# EAGLE design Retrotink5x_backwards (EAGLE 9.1.3)
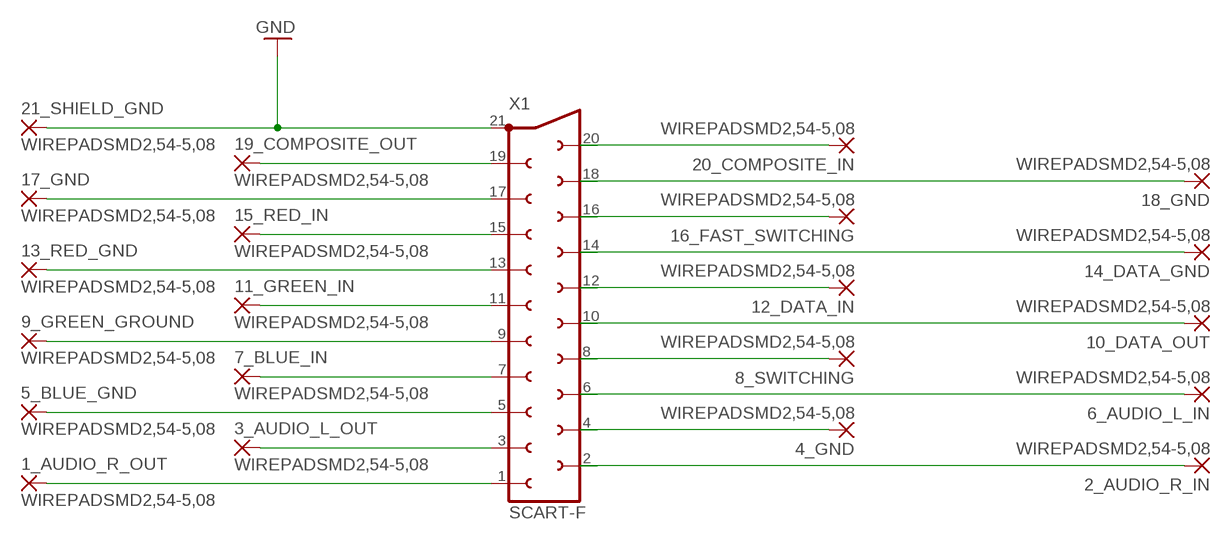
[diagram p0: schematic, sheet 1]

## Parts
1_AUDIO_R_OUT  WIREPADSMD2,54-5,08  [SMD2,54-5,08]
2_AUDIO_R_IN  WIREPADSMD2,54-5,08  [SMD2,54-5,08]
3_AUDIO_L_OUT  WIREPADSMD2,54-5,08  [SMD2,54-5,08]
4_GND  WIREPADSMD2,54-5,08  [SMD2,54-5,08]
5_BLUE_GND  WIREPADSMD2,54-5,08  [SMD2,54-5,08]
6_AUDIO_L_IN  WIREPADSMD2,54-5,08  [SMD2,54-5,08]
7_BLUE_IN  WIREPADSMD2,54-5,08  [SMD2,54-5,08]
8_SWITCHING  WIREPADSMD2,54-5,08  [SMD2,54-5,08]
9_GREEN_GROUND  WIREPADSMD2,54-5,08  [SMD2,54-5,08]
10_DATA_OUT  WIREPADSMD2,54-5,08  [SMD2,54-5,08]
11_GREEN_IN  WIREPADSMD2,54-5,08  [SMD2,54-5,08]
12_DATA_IN  WIREPADSMD2,54-5,08  [SMD2,54-5,08]
13_RED_GND  WIREPADSMD2,54-5,08  [SMD2,54-5,08]
14_DATA_GND  WIREPADSMD2,54-5,08  [SMD2,54-5,08]
15_RED_IN  WIREPADSMD2,54-5,08  [SMD2,54-5,08]
16_FAST_SWITCHING  WIREPADSMD2,54-5,08  [SMD2,54-5,08]
17_GND  WIREPADSMD2,54-5,08  [SMD2,54-5,08]
18_GND  WIREPADSMD2,54-5,08  [SMD2,54-5,08]
19_COMPOSITE_OUT  WIREPADSMD2,54-5,08  [SMD2,54-5,08]
20_COMPOSITE_IN  WIREPADSMD2,54-5,08  [SMD2,54-5,08]
21_SHIELD_GND  WIREPADSMD2,54-5,08  [SMD2,54-5,08]
X1  SCART-F  [SCART-F]

## Nets
GND: 21_SHIELD_GND.1(P) X1.21
N$1: 2_AUDIO_R_IN.1(P) X1.2
N$2: 1_AUDIO_R_OUT.1(P) X1.1
N$4: 20_COMPOSITE_IN.1(P) X1.20
N$5: 4_GND.1(P) X1.4
N$6: 6_AUDIO_L_IN.1(P) X1.6
N$7: 19_COMPOSITE_OUT.1(P) X1.19
N$8: 17_GND.1(P) X1.17
N$9: 18_GND.1(P) X1.18
N$10: 16_FAST_SWITCHING.1(P) X1.16
N$11: 15_RED_IN.1(P) X1.15
N$12: 3_AUDIO_L_OUT.1(P) X1.3
N$13: 5_BLUE_GND.1(P) X1.5
N$14: 7_BLUE_IN.1(P) X1.7
N$15: 8_SWITCHING.1(P) X1.8
N$16: 9_GREEN_GROUND.1(P) X1.9
N$17: 11_GREEN_IN.1(P) X1.11
N$18: 13_RED_GND.1(P) X1.13
N$19: 10_DATA_OUT.1(P) X1.10
N$20: 12_DATA_IN.1(P) X1.12
N$21: 14_DATA_GND.1(P) X1.14

## Library data of the parts
1_AUDIO_R_OUT 2_AUDIO_R_IN 3_AUDIO_L_OUT 4_GND 5_BLUE_GND 6_AUDIO_L_IN 7_BLUE_IN 8_SWITCHING 9_GREEN_GROUND 10_DATA_OUT 11_GREEN_IN 12_DATA_IN 13_RED_GND 14_DATA_GND 15_RED_IN 16_FAST_SWITCHING 17_GND 18_GND 19_COMPOSITE_OUT 20_COMPOSITE_IN 21_SHIELD_GND = wirepad:WIREPAD: Wire PAD connect wire on PCB
X1 = TRP_Custom:SCART-F: TV SCART CONNECTOR; OC_FARNELL: unknown; OC_NEWARK: unknown

## Board
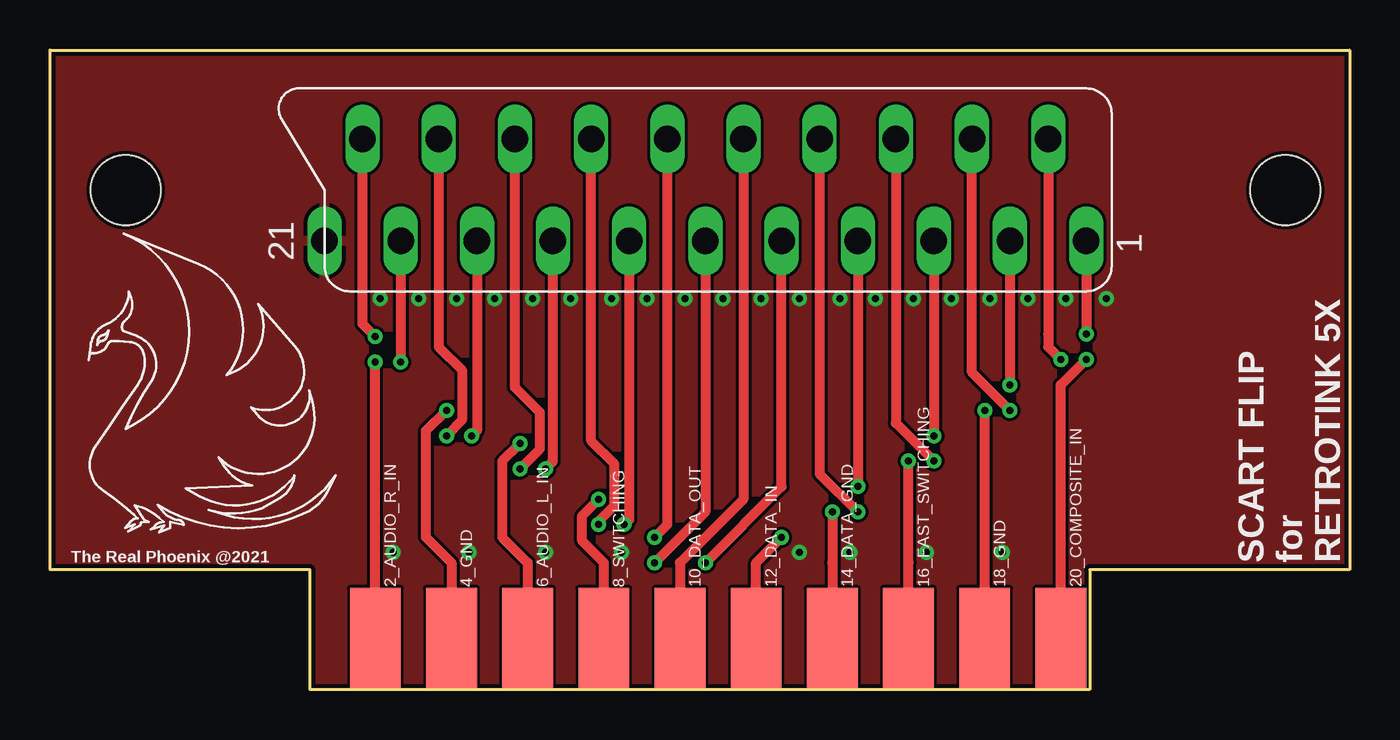
[diagram p1: board, top side]
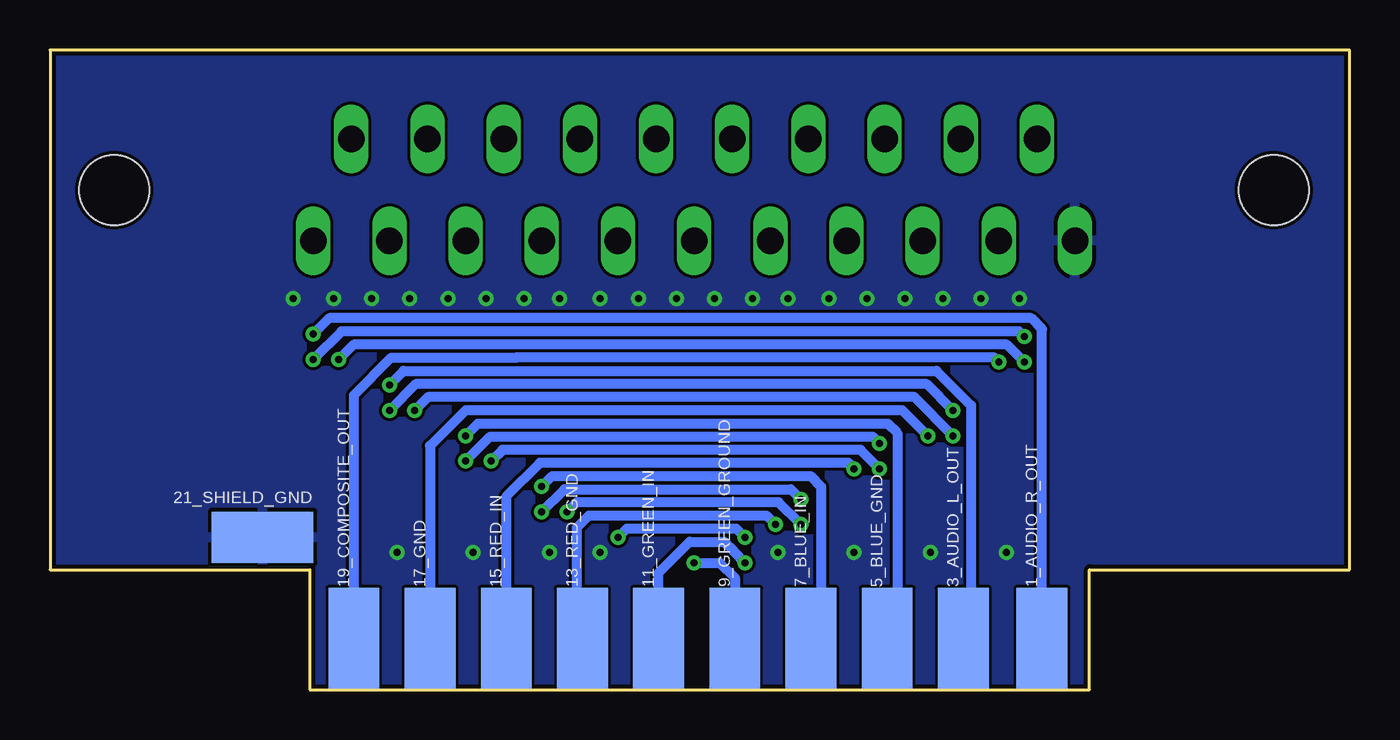
[diagram p2: board, bottom side, seen from below]

Size 65 x 32 mm. Coordinates in mm from the lower left corner, seen from the top.
Outline: 0,32 65,32 65,6 52,6 52,0 13,0 13,6 0,6 0,32
Copper layers (1*16): Top 0.035mm / dielectric 1.5mm / Bottom 0.035mm
Design rules "eC-PCB_proto-4-layer": minimum track width 0.15mm, minimum drill 0.25mm, track to track 0.15mm, track to pad 0.15mm, pad to pad 0.15mm, via to via 0.15mm, smd to smd 0.15mm, copper to edge 0.2mm, drill to drill 0.3mm, minimum pad ring 0.2mm, minimum via ring 0.2mm, stop-mask expansion 0.1mm, vias tented up to drill 0.6mm, thermal gap 0.2mm

### Footprints (pad centres in the part's own frame; a part is rotated, then mirrored left to right if it is on the bottom)
SMD2,54-5,08 = smd 2.54 x 5.08: 1 0,0
SCART-F = drill 1.321 long: 1 19.05,-2.54; 2 17.145,2.54; 3 15.24,-2.54; 4 13.335,2.54; 5 11.43,-2.54; 6 9.525,2.54; 7 7.62,-2.54; 8 5.715,2.54; 9 3.81,-2.54; 10 1.905,2.54; 11 0,-2.54; 12 -1.905,2.54; 13 -3.81,-2.54; 14 -5.715,2.54; 15 -7.62,-2.54; 16 -9.525,2.54; 17 -11.43,-2.54; 18 -13.335,2.54; 19 -15.24,-2.54; 20 -17.145,2.54; 21 -19.05,-2.54 | hole 3.5: 29,0; -29,0

### Placement (x,y rotation side)
1_AUDIO_R_OUT  15.38,2.54 0 bottom
2_AUDIO_R_IN  16.27,2.54 0 top
3_AUDIO_L_OUT  19.32,2.54 0 bottom
4_GND  20.08,2.54 0 top
5_BLUE_GND  23.13,2.54 0 bottom
6_AUDIO_L_IN  23.89,2.54 0 top
7_BLUE_IN  26.94,2.54 0 bottom
8_SWITCHING  27.7,2.54 0 top
9_GREEN_GROUND  30.75,2.54 0 bottom
10_DATA_OUT  31.51,2.54 0 top
11_GREEN_IN  34.56,2.54 0 bottom
12_DATA_IN  35.32,2.54 0 top
13_RED_GND  38.37,2.54 0 bottom
14_DATA_GND  39.13,2.54 0 top
15_RED_IN  42.18,2.54 0 bottom
16_FAST_SWITCHING  42.94,2.54 0 top
17_GND  45.99,2.54 0 bottom
18_GND  46.75,2.54 0 top
19_COMPOSITE_OUT  49.8,2.54 0 bottom
20_COMPOSITE_IN  50.56,2.54 0 top
21_SHIELD_GND  54.37,7.62 90 bottom
U$1  [LOGO]  -1.51,6.35 0 top
X1  32.78,25 0 top

### Tracks (layer width: path | path; a pad name or v marks a point on that pad's centre or on a via)
GND  (via drill 0.35)
  other vias: 16.52,19.56 20.33,19.56 22.24,19.56 24.14,19.56 28.08,19.56 29.86,19.56 31.76,19.56 26.05,19.56 33.67,19.56 35.57,19.56 37.48,19.56 39.51,19.56 41.29,19.56 52.85,19.56 50.81,19.56 48.91,19.56 47,19.56 45.1,19.56 43.19,19.56 18.43,19.56 17.16,6.86 20.97,6.86 24.78,6.86 47.64,6.86 43.83,6.86 40.02,6.86 28.59,6.86 37.48,6.86
  pour Bottom: -0.24,33.02 65.8,33.02 65.8,0 -0.24,0
  pour Top: -0.24,33.02 65.8,33.02 65.8,0 -0.24,0
N$1  (via drill 0.35)
  Top 0.508: 2_AUDIO_R_IN.1 v16.27,16.38 | X1.2 49.92,17.78 49.92,17.14 v50.56,16.51
  Bottom 0.508: v16.27,16.38 17.15,17.26 49.81,17.26 v50.56,16.51
N$2  (via drill 0.35)
  Top 0.508: X1.1 v51.83,17.78
  Bottom 0.508: 1_AUDIO_R_OUT.1 15.38,18.03 15.92,18.58 51.03,18.58 v51.83,17.78
N$4  (via drill 0.35)
  Top 0.508: 20_COMPOSITE_IN.1 50.56,15.24 v51.83,16.51 | X1.20 15.63,18.29 v16.27,17.65
  Bottom 0.508: v16.27,17.65 16.54,17.92 50.42,17.92 v51.83,16.51
N$5  (via drill 0.35)
  Top 0.508: v48.02,13.97 46.11,15.88 X1.4 | 4_GND.1 20.08,6.35 18.81,7.62 18.81,12.95 v19.83,13.97
  Bottom 0.508: v19.83,13.97 21.14,15.29 46.7,15.29 v48.02,13.97
N$6  (via drill 0.35)
  Top 0.508: X1.6 42.3,13.34 v44.21,11.43 | v23.51,12.32 22.62,11.43 22.62,7.62 23.89,6.35 6_AUDIO_L_IN.1
  Bottom 0.508: v23.51,12.32 23.84,12.65 42.99,12.65 v44.21,11.43
N$7  (via drill 0.35)
  Top 0.508: X1.19 v17.54,16.38
  Bottom 0.508: 19_COMPOSITE_OUT.1 49.8,14.73 47.93,16.6 41.7,16.6 41.67,16.6 17.76,16.6 v17.54,16.38
N$8  (via drill 0.35)
  Top 0.508: v21.1,12.7 21.22,12.83 21.35,12.95 X1.17
  Bottom 0.508: 17_GND.1 45.99,12.19 44.21,13.97 22.37,13.97 v21.1,12.7
N$9  (via drill 0.35)
  Top 0.508: 18_GND.1 v46.75,13.97 | X1.18 19.45,17.14 20.61,15.98 20.61,13.48 v19.83,12.7
  Bottom 0.508: v19.83,12.7 21.75,14.63 46.09,14.63 v46.75,13.97
N$10  (via drill 0.35)
  Top 0.508: X1.16 23.26,15.11 24.5,13.87 24.5,12.04 v23.51,11.05 | 16_FAST_SWITCHING.1 42.94,6.35 v42.94,11.43
  Bottom 0.508: v42.94,11.43 42.37,12 24.46,12 v23.51,11.05
N$11  (via drill 0.35)
  Top 0.508: X1.15 25.16,11.43 v24.78,11.05
  Bottom 0.508: 42.05,2.67 15_RED_IN.1 42.18,9.65 40.49,11.34 25.07,11.34 v24.78,11.05
N$12  (via drill 0.35)
  Top 0.508: X1.3 v48.02,15.24
  Bottom 0.508: 3_AUDIO_L_OUT.1 18.94,2.92 18.94,14.22 20.66,15.94 47.32,15.94 v48.02,15.24
N$13  (via drill 0.35)
  Top 0.508: X1.5 v44.21,12.7
  Bottom 0.508: v44.21,12.7 43.6,13.31 23.11,13.31 22.62,12.83 22.62,3.05 5_BLUE_GND.1
N$14  (via drill 0.35)
  Top 0.508: X1.7 v40.4,10.16
  Bottom 0.508: 7_BLUE_IN.1 26.43,3.05 26.43,6.86 26.43,10.16 26.95,10.68 39.88,10.68 v40.4,10.16
N$15  (via drill 0.35)
  Top 0.508: X1.8 38.49,10.79 v40.4,8.89 | v27.45,9.53 26.62,8.7 26.62,7.43 27.7,6.35 8_SWITCHING.1
  Bottom 0.508: v27.45,9.53 27.94,10.02 39.27,10.02 v40.4,8.89
N$16  (via drill 0.35)
  Top 0.508: X1.9 36.59,10.16 v32.78,6.35
  Bottom 0.508: v32.78,6.35 31.51,6.35 30.75,5.59 9_GREEN_GROUND.1
N$17  (via drill 0.35)
  Top 0.508: X1.11 32.78,8.89 v30.24,6.35
  Bottom 0.508: 35.24,2.46 35.15,2.54 11_GREEN_IN.1 34.56,5.84 33.01,7.39 31.28,7.39 | 30.79,6.9 v30.24,6.35 | 30.79,6.9 | 31.28,7.39 30.79,6.9 | 31.51,7.39 31.28,7.39
N$18  (via drill 0.35)
  Top 0.508: X1.13 28.97,8.51 v28.72,8.26
  Bottom 0.508: v28.72,8.26 29.17,8.71 38.04,8.71 38.64,8.11 38.64,2.54 13_RED_GND.1
  Bottom 0.813: 38.37,4.32 13_RED_GND.1
N$19
  Top 0.508: X1.10 34.68,9.53 31.51,6.35 10_DATA_OUT.1
N$20  (via drill 0.35)
  Top 0.508: X1.12 30.88,8.26 v30.24,7.62 | v36.59,7.62 35.32,6.35 12_DATA_IN.1
  Bottom 0.508: v30.24,7.62 30.67,8.05 36.16,8.05 v36.59,7.62
N$21  (via drill 0.35)
  Top 0.508: 14_DATA_GND.1 39.13,6.35 v39.13,8.89 | X1.14 27.07,12.45 28.23,11.29 28.23,9.2 27.45,8.42 v27.45,8.26
  Bottom 0.508: v27.45,8.26 28.56,9.36 38.66,9.36 v39.13,8.89

### Text on the board
tNames: The Real Phoenix @2021 | SCART FLIP / for / RETROTINK 5X